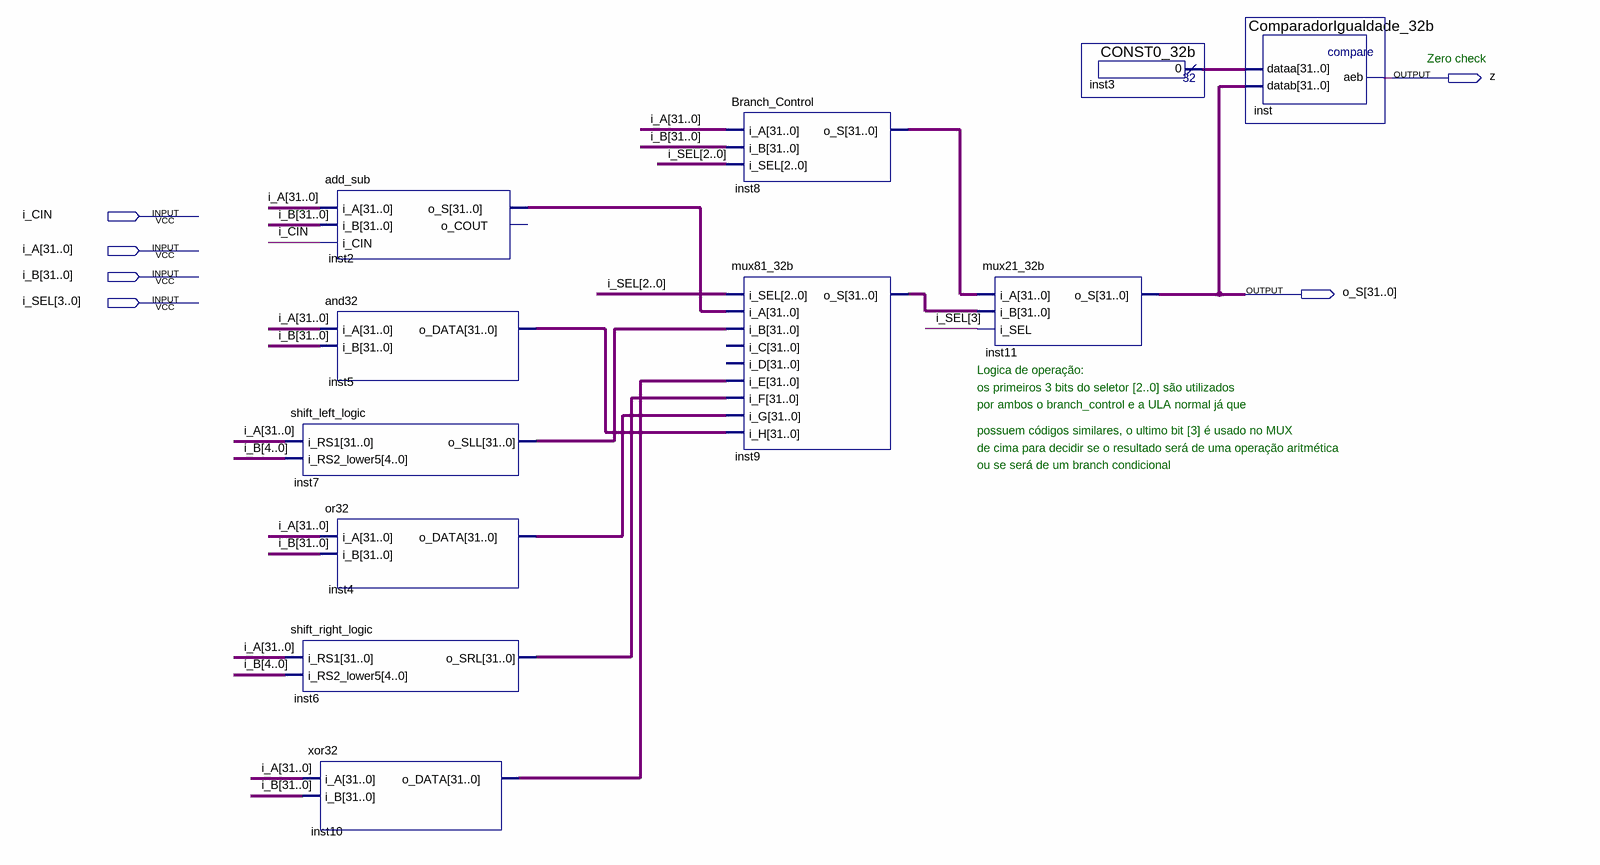
[diagram p0: schematic sheet]
// Quartus schematic ULA.bdf as structural Verilog: 11 symbols, 6 pins
module ULA (
  input  i_CIN,
  input  [31:0] i_A,
  input  [31:0] i_B,
  input  [3:0] i_SEL,
  output z,
  output [31:0] o_S
);

  wire [31:0] inst2_o_s, inst3_result, inst4_o_data, inst5_o_data, inst6_o_srl, inst7_o_sll, inst8_o_s,
       inst9_o_s, inst10_o_data;

  shift_left_logic inst7 (.i_RS1(i_A), .i_RS2_lower5(i_B[4:0]), .o_SLL(inst7_o_sll));
  shift_right_logic inst6 (.i_RS1(i_A), .i_RS2_lower5(i_B[4:0]), .o_SRL(inst6_o_srl));
  xor32 inst10 (.i_A(i_A), .i_B(i_B), .o_DATA(inst10_o_data));
  add_sub inst2 (.i_A(i_A), .i_B(i_B), .i_CIN(i_CIN), .o_S(inst2_o_s));  // open: o_COUT
  and32 inst5 (.i_A(i_A), .i_B(i_B), .o_DATA(inst5_o_data));
  or32 inst4 (.i_A(i_A), .i_B(i_B), .o_DATA(inst4_o_data));
  Branch_Control inst8 (.i_A(i_A), .i_B(i_B), .i_SEL(i_SEL[2:0]), .o_S(inst8_o_s));
  mux81_32b inst9 (
    .i_SEL(i_SEL[2:0]), .i_A(inst2_o_s), .i_B(inst7_o_sll), .i_E(inst10_o_data), .i_F(inst6_o_srl),
    .i_G(inst4_o_data), .i_H(inst5_o_data), .o_S(inst9_o_s));  // open: i_C, i_D
  mux21_32b inst11 (.i_A(inst8_o_s), .i_B(inst9_o_s), .i_SEL(i_SEL[3]), .o_S(o_S));
  CONST0_32b inst3 (.result(inst3_result));
  ComparadorIgualdade_32b inst (.dataa(inst3_result), .datab(o_S), .aeb(z));

  // Notes on the sheet:
  //   Zero check
  //   Logica de operação:
  //   os primeiros 3 bits do seletor [2..0] são utilizados
  //   por ambos o branch_control e a ULA normal já que
  //   possuem códigos similares, o ultimo bit [3] é usado no MUX
  //   de cima para decidir se o resultado será de uma operação aritmética
  //   ou se será de um branch condicional
endmodule
